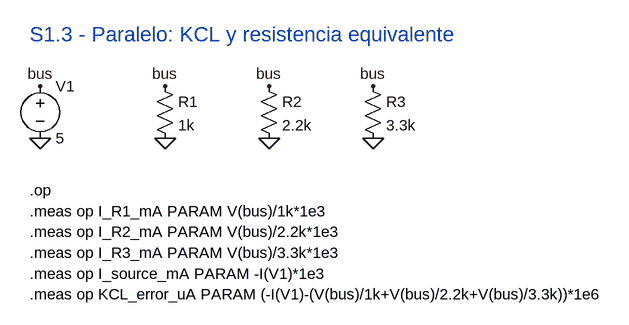
[diagram p0: schematic semana1_03_kcl_paralelo.asc]
semana1_03_kcl_paralelo.asc, the LTspice schematic file:
Version 4
SHEET 1 880 680
SYMBOL voltage 64 112 R0
SYMATTR InstName V1
SYMATTR Value 5
SYMBOL res 240 112 R0
SYMATTR InstName R1
SYMATTR Value 1k
SYMBOL res 400 112 R0
SYMATTR InstName R2
SYMATTR Value 2.2k
SYMBOL res 560 112 R0
SYMATTR InstName R3
SYMATTR Value 3.3k
FLAG 64 128 bus
FLAG 64 208 0
FLAG 256 128 bus
FLAG 256 208 0
FLAG 416 128 bus
FLAG 416 208 0
FLAG 576 128 bus
FLAG 576 208 0
TEXT 48 288 Left 2 !.op
TEXT 48 320 Left 2 !.meas op I_R1_mA PARAM V(bus)/1k*1e3
TEXT 48 352 Left 2 !.meas op I_R2_mA PARAM V(bus)/2.2k*1e3
TEXT 48 384 Left 2 !.meas op I_R3_mA PARAM V(bus)/3.3k*1e3
TEXT 48 416 Left 2 !.meas op I_source_mA PARAM -I(V1)*1e3
TEXT 48 448 Left 2 !.meas op KCL_error_uA PARAM (-I(V1)-(V(bus)/1k+V(bus)/2.2k+V(bus)/3.3k))*1e6
TEXT 48 48 Left 3 ;S1.3 - Paralelo: KCL y resistencia equivalente

The netlist it stands for:
* semana1_03_kcl_paralelo.asc
V1 bus 0 5
R1 bus 0 1k
R2 bus 0 2.2k
R3 bus 0 3.3k
.op
.meas op I_R1_mA PARAM V(bus)/1k*1e3
.meas op I_R2_mA PARAM V(bus)/2.2k*1e3
.meas op I_R3_mA PARAM V(bus)/3.3k*1e3
.meas op I_source_mA PARAM -I(V1)*1e3
.meas op KCL_error_uA PARAM (-I(V1)-(V(bus)/1k+V(bus)/2.2k+V(bus)/3.3k))*1e6
* S1.3 - Paralelo: KCL y resistencia equivalente
.backanno
.end